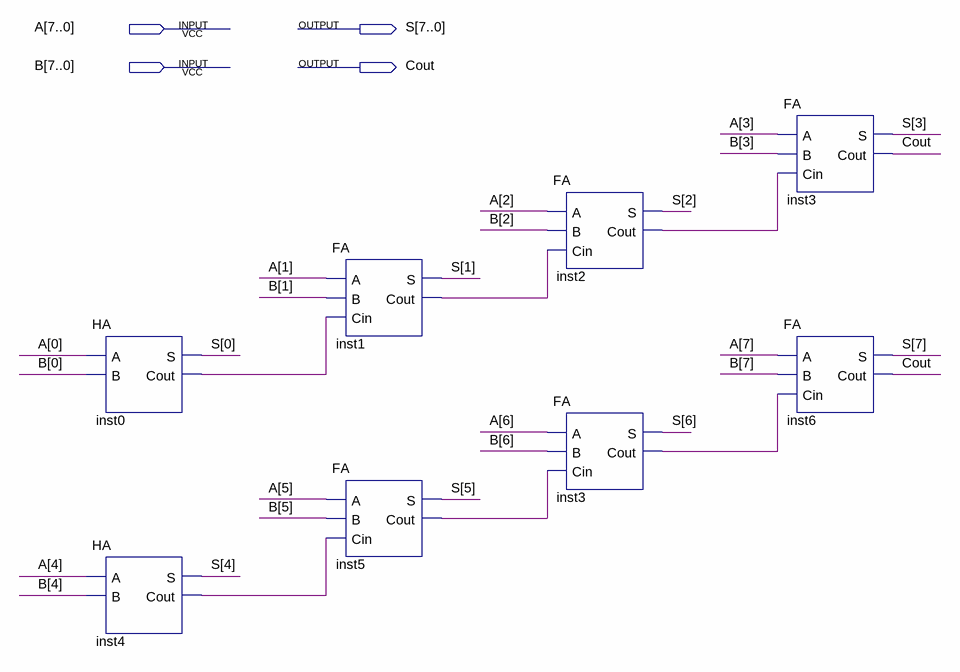
[diagram p0: schematic sheet]
// Quartus schematic RCA.bdf as structural Verilog: 8 symbols, 4 pins
module RCA (
  input  [7:0] A,
  input  [7:0] B,
  output [7:0] S,
  output Cout
);

  wire inst0_cout, inst1_cout, inst2_cout, inst3_cout, inst4_cout, inst5_cout;

  HA inst0 (.A(A[0]), .B(B[0]), .S(S[0]), .Cout(inst0_cout));
  HA inst4 (.A(A[4]), .B(B[4]), .S(S[4]), .Cout(inst4_cout));
  FA inst1 (.A(A[1]), .B(B[1]), .Cin(inst0_cout), .S(S[1]), .Cout(inst1_cout));
  FA inst5 (.A(A[5]), .B(B[5]), .Cin(inst4_cout), .S(S[5]), .Cout(inst5_cout));
  FA inst2 (.A(A[2]), .B(B[2]), .Cin(inst1_cout), .S(S[2]), .Cout(inst2_cout));
  FA inst3 (.A(A[6]), .B(B[6]), .Cin(inst5_cout), .S(S[6]), .Cout(inst3_cout));
  FA inst3_dup2 (.A(A[3]), .B(B[3]), .Cin(inst2_cout), .S(S[3]), .Cout(Cout));
  FA inst6 (.A(A[7]), .B(B[7]), .Cin(inst3_cout), .S(S[7]), .Cout(Cout));
endmodule
